# EAGLE design main-board (EAGLE 6.4)
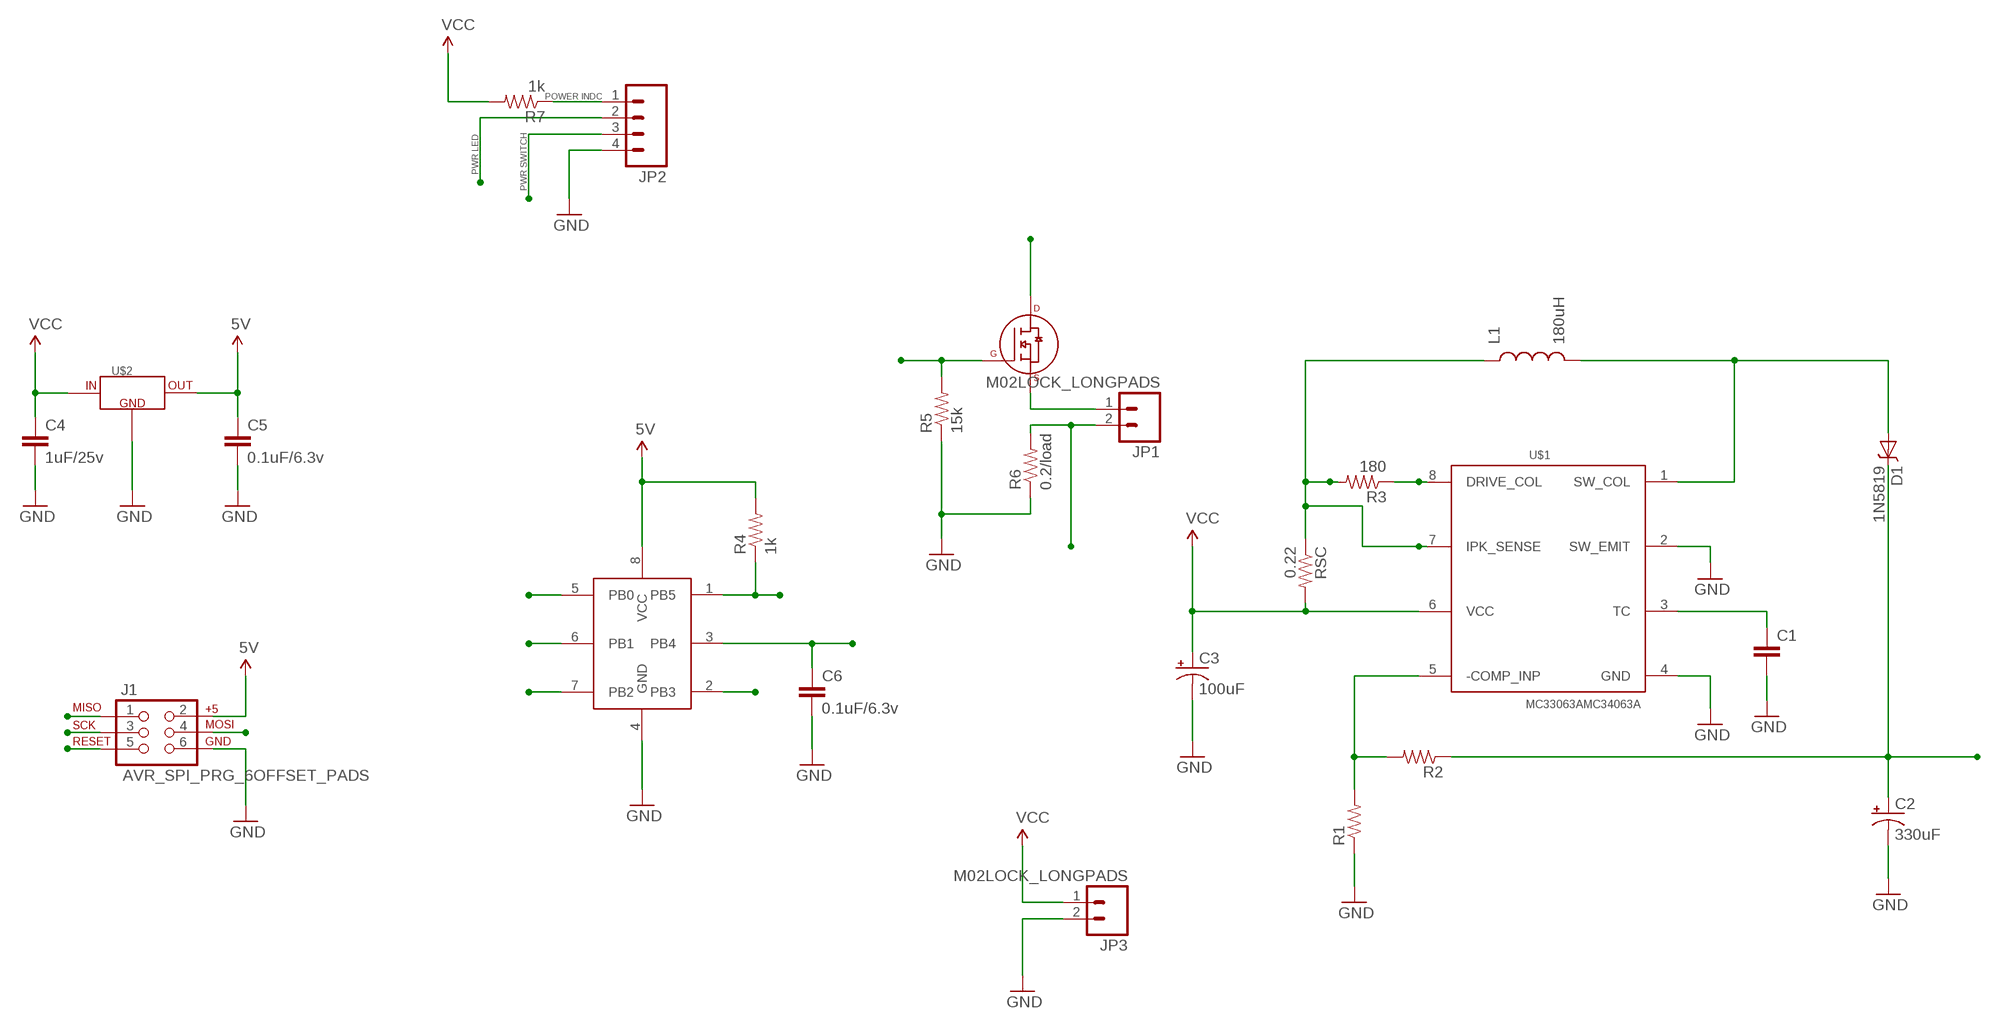
[diagram p0: schematic, sheet 1]

## Parts
C1  CAP0603-CAP  [0603-CAP]
C2  330uF  CPOL-USD  [PANASONIC_D]
C3  100uF  CPOL-USD  [PANASONIC_D]
C4  1uF/25v  CAP0603-CAP  [0603-CAP]
C5  0.1uF/6.3v  CAP0603-CAP  [0603-CAP]
C6  0.1uF/6.3v  CAP0603-CAP  [0603-CAP]
D1  1N5819  DIODE-SCHOTTKY_  [SMA-DIODE]
J1  AVR_SPI_PRG_6OFFSET_PADS  [2X3_OFFSET]
JP1  M02LOCK_LONGPADS  [1X02_LOCK_LONGPADS]
JP2  M04LONGPADS  [1X04_LONGPADS]
JP3  M02LOCK_LONGPADS  [1X02_LOCK_LONGPADS]
L1  180uH  INDUCTORPWR  [CDRH125]
R1  RESISTOR0603  [0603-RES]
R2  RESISTOR0603  [0603-RES]
R3  180  RESISTOR0603  [0603-RES]
R4  1k  RESISTOR0603-RES  [0603-RES]
R5  15k  RESISTOR0603-RES  [0603-RES]
R6  0.2/load  RESISTOR0805-RES  [0805]
R7  1k  RESISTOR0603-RES  [0603-RES]
RSC  0.22  RESISTOR0603  [0603-RES]
U$1  MC33063AMC34063A  [SOIC-8]
U$2  TPS715XX  [SC70-5]
U$3  ATTINY13  [WSOIC-8]
U$4  FQB30N06LTM  [TO-263AB]

## Nets
5V: C5.1 J1.2 R4.2 U$2.5(OUT) U$3.8(VCC)
GND: C1.2 C2.- C3.- C4.2 C5.2 C6.2 J1.6 JP2.4 JP3.2 R1.1 R5.1 R6.1 U$1.2(SW_EMIT) U$1.4(GND) U$2.2(GND) U$3.4(GND)
LED+: C2.+ D1.C R2.1 U$4.4(D)
MISO: J1.1 U$3.6(PB1)
MOSI: J1.4 R5.2 U$3.5(PB0) U$4.1(G)
N$1: R1.2 R2.2 U$1.5(-COMP_INP)
N$2: JP1.1 U$4.3(S)
N$3: JP2.1 R7.1
N$4: L1.1 R3.2 RSC.1 U$1.7(IPK_SENSE)
N$5: R3.1 U$1.8(DRIVE_COL)
N$6: D1.A L1.2 U$1.1(SW_COL)
N$8: C1.1 U$1.3(TC)
PWR_LED: JP2.2 U$3.2(PB3)
RESET: J1.5 R4.1 U$3.1(PB5)
SCK: J1.3 JP2.3 U$3.7(PB2)
SENSE: C6.1 JP1.2 R6.2 U$3.3(PB4)
VCC: C3.+ C4.1 JP3.1 R7.2 RSC.2 U$1.6(VCC) U$2.4(IN)

## Notes on the sheet
- POWER INDC
- PWR LED
- PWR SWITCH

## Library data of the parts
C1 = SparkFun-Passives:CAP: Capacitor Standard 0603 ceramic capacitor, and 0.1" leaded capacitor.
C2 C3 = resistor:CPOL-US: POLARIZED CAPACITOR, American symbol
C4-C6 = SparkFun-Capacitors:CAP: Capacitor Standard 0603 ceramic capacitor, and 0.1" leaded capacitor.
D1 = SparkFun-DiscreteSemi:DIODE-SCHOTTKY: Commonly MBRA140.
J1 = SparkFun-Connectors:AVR_SPI_PRG_6: AVR ISP 6 Pin This is the reduced ISP connector for AVR programming. Common on Arduino. This footprint will take up less PCB space and can be used with a 10-pin to 6-pin adapter such as SKU: BOB-08508
JP1 JP3 = SparkFun-Connectors:M02: Standard 2-pin 0.1" header. Use with - straight break away headers ( PRT-00116) - right angle break away headers (PRT-00553) - swiss pins (PRT-00743) - machine pins (PRT-00117) - female headers (PRT-00115) Molex polarized connector foot print use with: PRT-08233 with associated crimp pins and housings. 2.54_SCREWTERM for use with PRT-10571. 3.5mm Screw Terminal footprints for PRT-08084 5mm Screw Terminal footprints for use with PRT-08433
JP2 = SparkFun-Connectors:M04: Header 4 Standard 4-pin 0.1" header. Use with straight break away headers (SKU : PRT-00116), right angle break away headers (PRT-00553), swiss pins (PRT-00743), machine pins (PRT-00117), and female headers (PRT-00115). Molex polarized connector foot print use with SKU : PRT-08231 with associated crimp pins and housings. 1MM SMD Version SKU: PRT-10208
L1 = SparkFun-Passives:INDUCTOR: Inductors Basic Inductor/Choke - 0603 and 1206. Footprints are not proven and vary greatly between part numbers.
R1-R3 RSC = SparkFun-Resistors:RESISTOR: Resistor Basic schematic elements and footprints for 0603, 1206, and PTH resistors.
R4-R7 = SparkFun-Passives:RESISTOR: Resistor Basic schematic elements and footprints for 0603, 1206, and PTH resistors.
U$1 = Synapseware:MC33063A: 1.5-A PEAK BOOST/BUCK/INVERTING SWITCHING REGULATORS The MC33063A and MC34063A are easy-to-use ICs containing all the primary circuitry needed for building simple dc-dc converters. These devices primarily consist of an internal temperature-compensated reference, a comparator, an oscillator, a PWM controller with active current limiting, a driver, and a high-current output switch. Thus, the devices require minimal external components to build converters in the boost, buck, and inverting topologies.
U$2 = Synapseware:TPS715XX: 50 mA, 24 V, 3.2-uA Supply Current Low-Dropout Linear Regulator in SC70 (SOT-323) Package TPS71550DCKR - 5.0V version TPS71533DCKR - 3.3V version TPS71525DCKR - 2.5V version
U$3 = Synapseware:ATTINY13: The ATtiny13 is a low-power CMOS 8-bit microcontroller based on the AVR enhanced RISC architecture. By executing powerful instructions in a single clock cycle, the ATtiny13 achieves throughputs approaching 1 MIPS per MHz allowing the system designer to optimize power consumption versus processing speed.
U$4 = Synapseware:FQB30N06LTM: 60V LOGIC N-Channel MOSFET

## Board
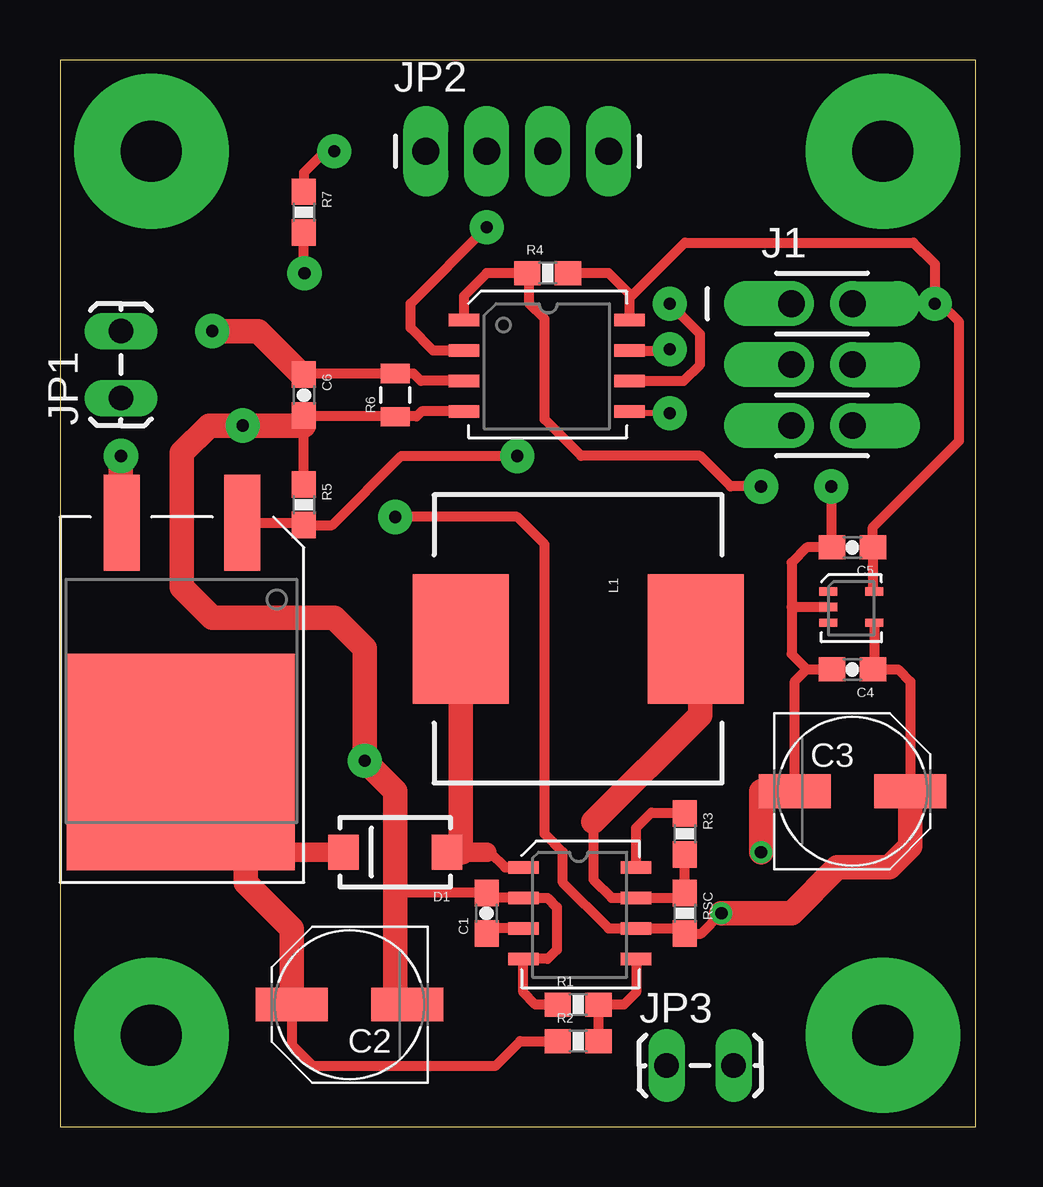
[diagram p1: board, top side]
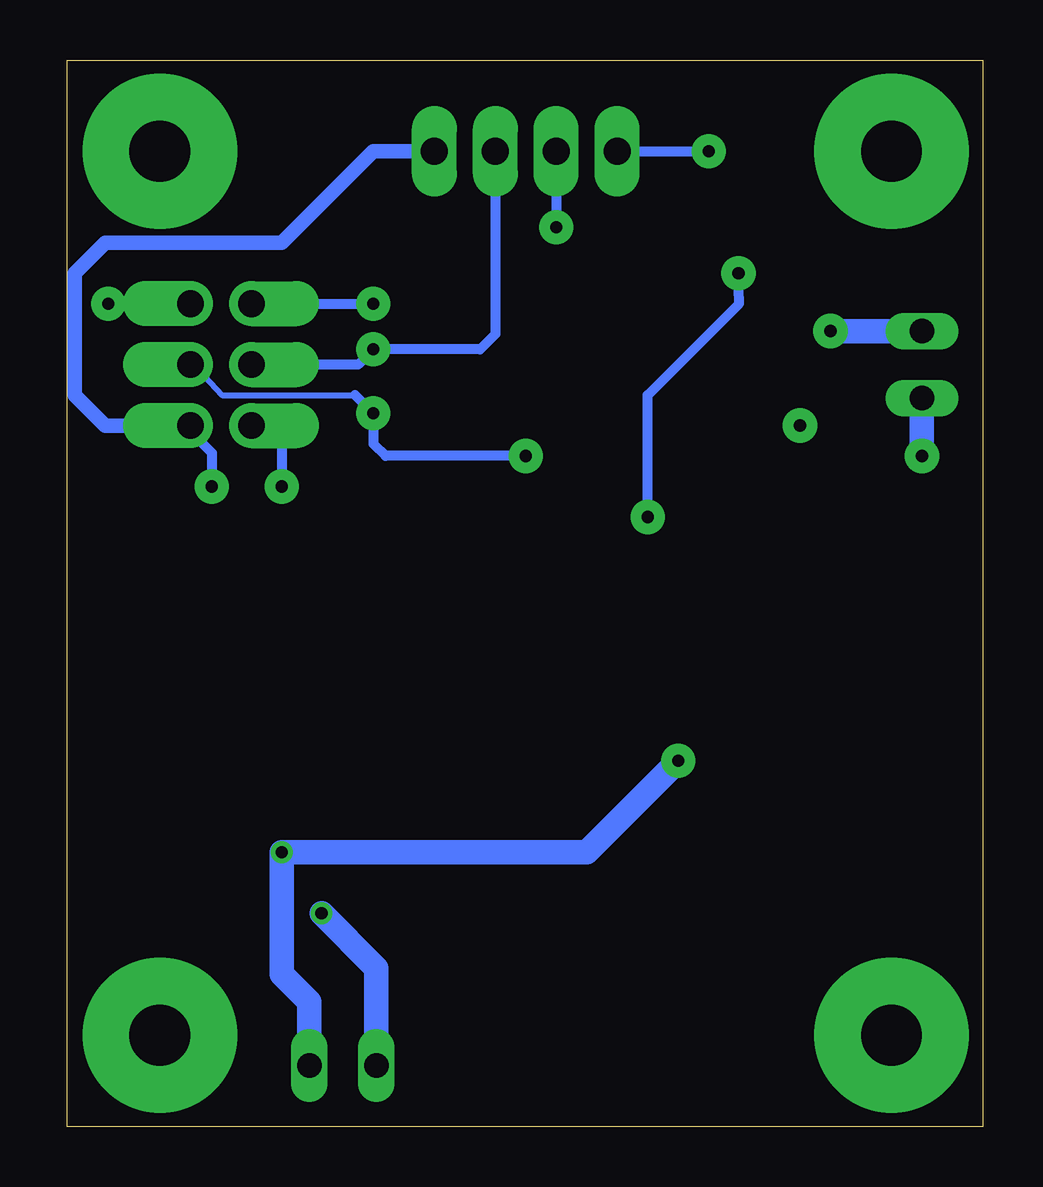
[diagram p2: board, bottom side, seen from below]

Size 38.15 x 44.44 mm. Coordinates in mm from the lower left corner, seen from the top.
Outline: 0,0 38.15,0 38.15,44.44 0,44.44 0,0
Copper layers (1*16): Top 0.035mm / dielectric 1.5mm / Bottom 0.035mm
Design rules "default": minimum track width 10mil, minimum drill 0.6mm, track to track 8mil, track to pad 8mil, pad to pad 8mil, via to via 8mil, smd to smd 8mil, copper to edge 40mil, drill to drill 8mil, minimum pad ring 10mil, minimum via ring 8mil, stop-mask expansion 4mil, vias tented up to drill 0mil, thermal gap 10mil

### Footprints (pad centres in the part's own frame; a part is rotated, then mirrored left to right if it is on the bottom)
0603-CAP = smd 1.1 x 1: 1 -0.85,0; 2 0.85,0
PANASONIC_D = smd 3 x 1.4: + 2.4,0; - -2.4,0
SMA-DIODE = smd 1.27 x 1.47: A -2.15,0; C 2.15,0
2X3_OFFSET = drill 1.118 pad 1.88 offset: 1 -2.54,-1.27; 2 -2.54,1.27; 3 0,-1.27; 4 0,1.27; 5 2.54,-1.27; 6 2.54,1.27
1X02_LOCK_LONGPADS = drill 1.016 long: 1 -0.127,0; 2 2.667,0
1X04_LONGPADS = drill 1.118 pad 1.88 long: 1 0,0; 2 2.54,0; 3 5.08,0; 4 7.62,0
CDRH125 = smd 5.4 x 4: 1 0,4.9; 2 0,-4.9
0603-RES = smd 1.1 x 1: 1 -0.85,0; 2 0.85,0
0805 = smd 0.8 x 1.2: 1 -0.9,0; 2 0.9,0
SOIC-8 = smd 0.508 x 1.27: 1 -1.905,-2.286; 2 -0.635,-2.286; 3 0.635,-2.286; 4 1.905,-2.286; 5 1.905,2.413; 6 0.635,2.413; 7 -0.635,2.413; 8 -1.905,2.413
SC70-5 = smd 0.35 x 0.75: 1 -0.7,-1; 2 -0.05,-1; 3 0.6,-1; 4 0.6,0.9; 5 -0.7,0.9
WSOIC-8 = smd 0.508 x 1.27: 1 -1.855,-3.486; 2 -0.585,-3.486; 3 0.685,-3.486; 4 1.955,-3.486; 5 1.955,3.413; 6 0.685,3.413; 7 -0.585,3.413; 8 -1.855,3.413
TO-263AB = smd 1.5 x 4: 1 -2.517,-8.652; 3 2.517,-8.652 | smd 9.5 x 9: 4 0.05,1.32

### Placement (x,y rotation side)
C1  17.78,8.89 90 top
C2  12.06,5.08 180 top
C3  33.02,13.97 0 top
C4  33.02,19.05 180 top
C5  33.02,24.13 180 top
C6  10.16,30.48 270 top
D1  13.97,11.43 180 top
J1  31.75,31.75 270 top
JP1  2.54,30.48 90 top
JP2  15.24,40.64 0 top
JP3  25.4,2.54 0 top
L1  21.59,20.32 270 top
R1  21.59,5.08 0 top
R2  21.59,3.56 0 top
R3  26.04,12.19 270 top
R4  20.32,35.56 0 top
R5  10.16,25.91 270 top
R6  13.97,30.48 90 top
R7  10.16,38.1 270 top
RSC  26.04,8.89 270 top
U$1  21.59,8.89 270 top
U$2  33.02,21.59 270 top
U$3  20.32,31.75 270 top
U$4  5.08,16.51 180 top

### Tracks (layer width: path | path; a pad name or v marks a point on that pad's centre or on a via)
5V  (via drill 0.51 pad 1.42)
  Top 0.406: R4.2 22.86,35.56 23.73,34.69 U$3.8 23.73,34.53 26.04,36.83 35.56,36.83 36.45,35.94 v36.45,34.29 36.7,34.29 37.47,33.53 37.47,28.57 33.87,24.98 C5.1 33.87,22.34 U$2.5
  Bottom 0.406: J1.2 v36.45,34.29
GND  (via drill 0.51, 0.51 pad 1.42)
  Top 0.406: R1.1 19.81,5.08 19.3,5.59 U$1.4 20.32,6.99 20.7,7.37 20.7,9.14 20.32,9.53 U$1.2 18.03,9.53 17.91,9.65 18,9.65 C1.2 14.14,9.74 13.97,9.91 | C5.2 31.11,24.13 30.48,23.5 30.48,21.64 | 30.48,21.64 30.48,19.68 31.11,19.05 | 31.11,19.05 C4.2 | U$2.2 30.48,21.64 | C5.2 32.13,24.13 | C3.- 30.62,18.55 31.11,19.05 | 13.98,29.59 10.33,29.59 C6.2 | R5.1 10.16,29.21 | 10.16,29.21 C6.2 | 10.16,29.21 10.25,29.34 C6.2 | U$3.4 15.06,29.8 14.86,29.59 13.98,29.59 | 13.98,29.59 R6.1 | v32.13,26.67 32.13,24.17 C5.2
  Top 1.016: C2.- 13.97,5.09 13.97,9.91 13.97,13.97 v12.7,15.24 12.7,19.94 11.43,21.21 6.35,21.21 5.08,22.48 5.08,28.07 6.22,29.21 v7.62,29.21 10.16,29.21 | 30.48,13.83 C3.- 29.21,13.97 v29.21,11.43
  Bottom 0.406: J1.6 33.02,28.96 32.13,28.07 v32.13,26.67
  Bottom 0.61: JP2.4 25.4,40.64 29.21,36.83 36.58,36.83 37.85,35.56 37.85,30.48 36.58,29.21 J1.6
  Bottom 1.016: v12.7,15.24 16.51,11.43 v29.21,11.43 29.21,6.35 28.07,5.21 JP3.2
LED+
  Top 0.406: C2.+ 9.66,3.42 10.54,2.54 18.16,2.54 19.18,3.56 R2.1
  Top 0.813: U$4.4 5.03,14.02 7.37,11.68 7.62,11.43 | 7.62,11.43 D1.C | 7.76,11.29 7.62,11.43
  Top 1.016: C2.+ 9.66,8.24 7.75,10.16 7.75,12.06 7.37,11.68
MISO  (via drill 0.51 pad 1.42)
  Top 0.406: U$3.6 25.98,31.07 26.67,31.75 26.67,33.02 v25.4,34.29
  Bottom 0.406: J1.1 v25.4,34.29
MOSI  (via drill 0.51 pad 1.42)
  Top 0.254: 32.92,31.8 J1.4 | v25.4,29.72 23.81,29.72 U$3.5
  Top 0.406: U$4.1 10.06,25.16 R5.2 11.34,25.06 14.22,27.94 v19.05,27.94
  Bottom 0.254: 26.16,30.48 31.7,30.48 32.92,31.8 J1.4
  Bottom 0.406: v19.05,27.94 24.89,27.94 25.4,28.45 v25.4,29.72 26.16,30.48
N$1
  Top 0.406: 22.57,4.95 R1.2 | R2.2 R1.2 | U$1.5 24,5.59 23.5,5.08 R1.2
N$2  (via drill 0.51 pad 1.42)
  Top 1.016: v2.54,27.94 2.54,25.18 U$4.3
  Bottom 1.016: JP1.1 v2.54,27.94
N$3  (via drill 0.51 pad 1.42)
  Top 0.406: v11.43,40.64 11.05,40.64 10.16,39.75 R7.1
  Bottom 0.406: JP2.1 v11.43,40.64
N$4
  Top 0.406: 22.23,12.7 22.23,10.29 22.99,9.53 U$1.7 25.82,9.53 RSC.1 R3.2
  Top 1.016: L1.1 26.16,20.32 | 25.4,20.32 26.16,20.32 | 26.16,20.32 26.67,19.81 26.67,17.14 22.23,12.7
N$5
  Top 0.406: U$1.8 24,12.45 24.64,13.08 26,13.08 R3.1
N$6
  Top 0.406: 17.78,11.43 17.91,11.43 18.54,10.79 U$1.1
  Top 0.813: D1.A 16.76,11.43 17.78,11.43
  Top 1.016: L1.2 16.69,11.5 16.76,11.43
N$8
  Top 0.406: U$1.3 17.87,8.26 C1.1
N$10  (via drill 2.54 pad 6.45)
  other vias: 3.81,3.81
N$11  (via drill 2.54 pad 6.45)
  other vias: 34.29,3.81
N$12  (via drill 2.54 pad 6.45)
  other vias: 34.29,40.64
N$13  (via drill 2.54 pad 6.45)
  other vias: 3.81,40.64
PWR_LED  (via drill 0.51 pad 1.42)
  Top 0.406: U$3.2 15.54,32.34 14.61,33.27 14.61,34.29 v17.78,37.47
  Bottom 0.406: JP2.2 v17.78,37.47
RESET  (via drill 0.51 pad 1.42)
  Top 0.254: 19.51,35.46 R4.1
  Top 0.406: U$3.1 16.83,34.61 17.78,35.56 R4.1 19.56,35.47 19.56,34.29 20.19,33.66 20.19,29.46 21.72,27.94 26.67,27.94 27.94,26.67 v29.21,26.67 | 30.48,29.16 J1.5
  Bottom 0.406: J1.5 29.21,29.21 v29.21,26.67
SCK  (via drill 0.51 pad 1.42)
  Top 0.254: 23.57,32.21 U$3.7
  Top 0.406: U$3.7 25.35,32.34 v25.4,32.38
  Bottom 0.254: 30.48,31.8 J1.3
  Bottom 0.406: JP2.3 20.32,33.02 20.95,32.38 v25.4,32.38 26.04,31.75 J1.3
SENSE  (via drill 0.51 pad 1.42)
  Top 0.406: U$3.3 15.04,31.07 14.73,31.37 R6.2 | R6.2 | R6.2 10.2,31.37 | 10.2,31.37 C6.1 10.12,31.37 | 10.03,31.37 10.12,31.37 | 10.2,31.37 10.12,31.37
  Top 1.016: 10.03,31.37 8.26,33.15 v6.35,33.15
  Bottom 1.016: JP1.2 v6.35,33.15
VCC  (via drill 0.51, 0.51 pad 1.42)
  Top 0.406: U$2.4 33.92,19.1 C4.1 34.92,19.05 35.43,18.54 35.43,13.98 C3.+ | v10.19,35.56 10.16,35.56 R7.2 | v13.97,25.4 19.05,25.4 20.19,24.26 20.19,12.19 20.95,11.43 20.95,10.16 22.86,8.26 U$1.6 25.82,8.26 RSC.2 26.71,8.04 v27.56,8.89
  Top 1.016: C3.+ 35.42,11.67 34.54,10.79 32.38,10.79 30.48,8.89 v27.56,8.89
  Bottom 0.406: v13.97,25.4 13.97,30.48 10.16,34.29 v10.19,35.56
  Bottom 1.016: JP3.1 25.27,6.6 v27.56,8.89